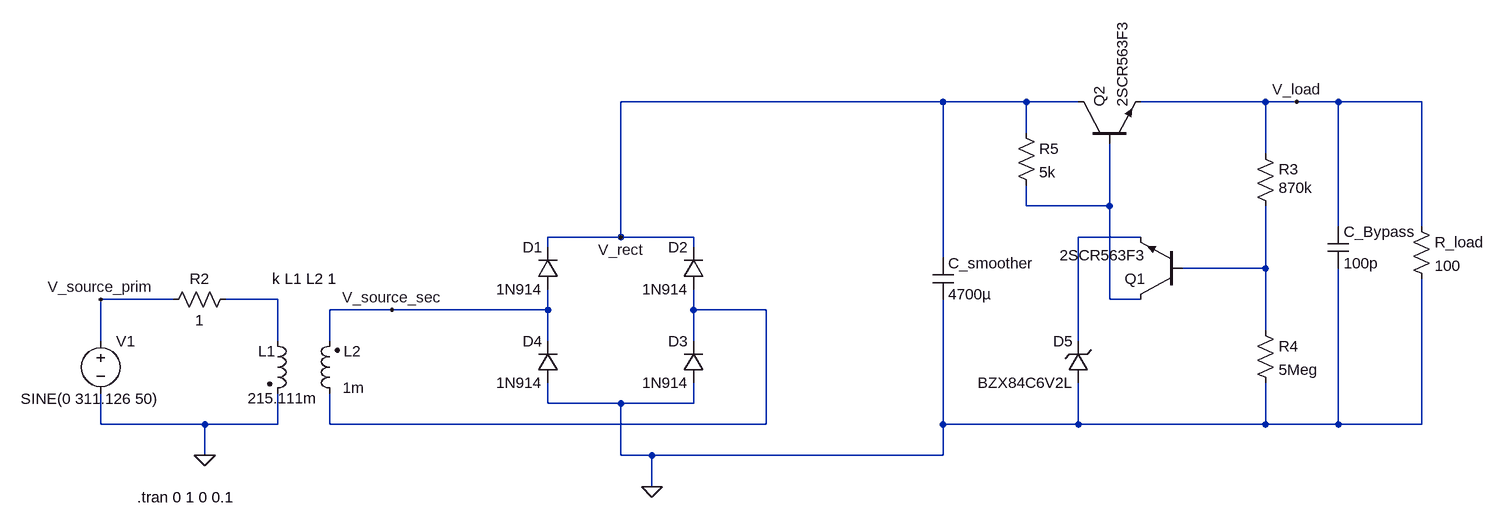
[diagram p0: schematic Linear Power Supply_proposal_V3_realistic_final.asc]
Linear Power Supply_proposal_V3_realistic_final.asc, the LTspice schematic file:
Version 4
SHEET 1 2792 680
WIRE 1232 -144 736 -144
WIRE 1360 -144 1232 -144
WIRE 1440 -144 1360 -144
WIRE 1728 -144 1536 -144
WIRE 1776 -144 1728 -144
WIRE 1840 -144 1776 -144
WIRE 1968 -144 1840 -144
WIRE 1360 -96 1360 -144
WIRE 1728 -64 1728 -144
WIRE 1360 16 1360 -16
WIRE 1488 16 1488 -80
WIRE 1488 16 1360 16
WIRE 1840 48 1840 -144
WIRE 1968 48 1968 -144
WIRE 736 64 736 -144
WIRE 736 64 624 64
WIRE 848 64 736 64
WIRE 1536 64 1440 64
WIRE 624 80 624 64
WIRE 848 80 848 64
WIRE 1232 96 1232 -144
WIRE 1728 112 1728 16
WIRE 1728 112 1600 112
WIRE 48 160 -64 160
WIRE 208 160 128 160
WIRE 1488 160 1488 16
WIRE 1536 160 1488 160
WIRE 384 176 288 176
WIRE 624 176 624 144
WIRE 624 176 384 176
WIRE 848 176 848 144
WIRE 960 176 848 176
WIRE 1728 208 1728 112
WIRE -64 224 -64 160
WIRE 208 224 208 160
WIRE 288 224 288 176
WIRE 624 224 624 176
WIRE 848 224 848 176
WIRE 1440 224 1440 64
WIRE 624 320 624 288
WIRE 736 320 624 320
WIRE 848 320 848 288
WIRE 848 320 736 320
WIRE -64 352 -64 304
WIRE 96 352 -64 352
WIRE 208 352 208 304
WIRE 208 352 96 352
WIRE 288 352 288 304
WIRE 960 352 960 176
WIRE 960 352 288 352
WIRE 1232 352 1232 160
WIRE 1440 352 1440 288
WIRE 1440 352 1232 352
WIRE 1728 352 1728 288
WIRE 1728 352 1440 352
WIRE 1840 352 1840 112
WIRE 1840 352 1728 352
WIRE 1968 352 1968 128
WIRE 1968 352 1840 352
WIRE 96 400 96 352
WIRE 736 400 736 320
WIRE 784 400 736 400
WIRE 1232 400 1232 352
WIRE 1232 400 784 400
WIRE 784 448 784 400
FLAG 96 400 0
FLAG -64 160 V_source_prim
FLAG 384 176 V_source_sec
FLAG 736 64 V_rect
FLAG 1776 -144 V_load
FLAG 784 448 0
SYMBOL voltage -64 208 R0
WINDOW 3 -123 105 Left 2
WINDOW 123 0 0 Left 0
WINDOW 39 0 0 Left 0
SYMATTR Value SINE(0 311.126 50)
SYMATTR InstName V1
SYMBOL ind2 192 208 R0
WINDOW 0 -14 32 Left 2
WINDOW 3 -30 104 Left 2
SYMATTR InstName L1
SYMATTR Value 215.111m
SYMATTR Type ind
SYMBOL ind2 304 320 R180
WINDOW 0 -33 80 Left 2
WINDOW 3 -38 24 Left 2
SYMATTR InstName L2
SYMATTR Value 1m
SYMATTR Type ind
SYMBOL diode 640 144 R180
WINDOW 0 24 64 Left 2
WINDOW 3 24 0 Left 2
SYMATTR InstName D1
SYMATTR Value 1N914
SYMBOL diode 864 144 R180
WINDOW 0 24 64 Left 2
WINDOW 3 24 0 Left 2
SYMATTR InstName D2
SYMATTR Value 1N914
SYMBOL diode 864 288 R180
WINDOW 0 24 64 Left 2
WINDOW 3 24 0 Left 2
SYMATTR InstName D3
SYMATTR Value 1N914
SYMBOL diode 640 288 R180
WINDOW 0 24 64 Left 2
WINDOW 3 24 0 Left 2
SYMATTR InstName D4
SYMATTR Value 1N914
SYMBOL res 144 144 R90
WINDOW 0 0 56 VBottom 2
WINDOW 3 32 56 VTop 2
SYMATTR InstName R2
SYMATTR Value 1
SYMBOL cap 1216 96 R0
SYMATTR InstName C_smoother
SYMATTR Value 4700µ
SYMBOL zener 1456 288 R180
WINDOW 0 24 64 Left 2
WINDOW 3 24 0 Left 2
SYMATTR InstName D5
SYMATTR Value BZX84C6V2L
SYMATTR Description Diode
SYMATTR Type diode
SYMBOL npn 1440 -80 R270
SYMATTR InstName Q2
SYMATTR Value 2SCR563F3
SYMBOL npn 1600 160 R180
SYMATTR InstName Q1
SYMATTR Value 2SCR563F3
SYMBOL res 1952 32 R0
SYMATTR InstName R_load
SYMATTR Value 100
SYMBOL res 1712 -80 R0
WINDOW 3 36 68 Left 2
SYMATTR Value 870k
SYMATTR InstName R3
SYMBOL res 1712 192 R0
SYMATTR InstName R4
SYMATTR Value 5Meg
SYMBOL res 1344 -112 R0
SYMATTR InstName R5
SYMATTR Value 5k
SYMBOL cap 1824 48 R0
SYMATTR InstName C_Bypass
SYMATTR Value 100p
TEXT 200 128 Left 2 !k L1 L2 1
TEXT -8 464 Left 2 !.tran 0 1 0 0.1

The netlist it stands for:
* Linear Power Supply_proposal_V3_realistic_final.asc
V1 V_source_prim 0 SINE(0 311.126 50)
L1 N004 0 215.111m
L2 N005 V_source_sec 1m
D1 V_source_sec V_rect 1N914
D2 N005 V_rect 1N914
D3 0 N005 1N914
D4 0 V_source_sec 1N914
R2 N004 V_source_prim 1
C_smoother V_rect 0 4700µ
D5 0 N002 BZX84C6V2L
Q2 V_rect N001 V_load 0 2SCR563F3
Q1 N001 N003 N002 0 2SCR563F3
R_load V_load 0 100
R3 V_load N003 870k
R4 N003 0 5Meg
R5 V_rect N001 5k
C_Bypass V_load 0 100p
.model D D
.lib standard.dio
.model NPN NPN
.model PNP PNP
.lib standard.bjt
k L1 L2 1
.tran 0 1 0 0.1
.backanno
.end